# EAGLE schematic ds18b20-stm32f103 (EAGLE 7.2.0)
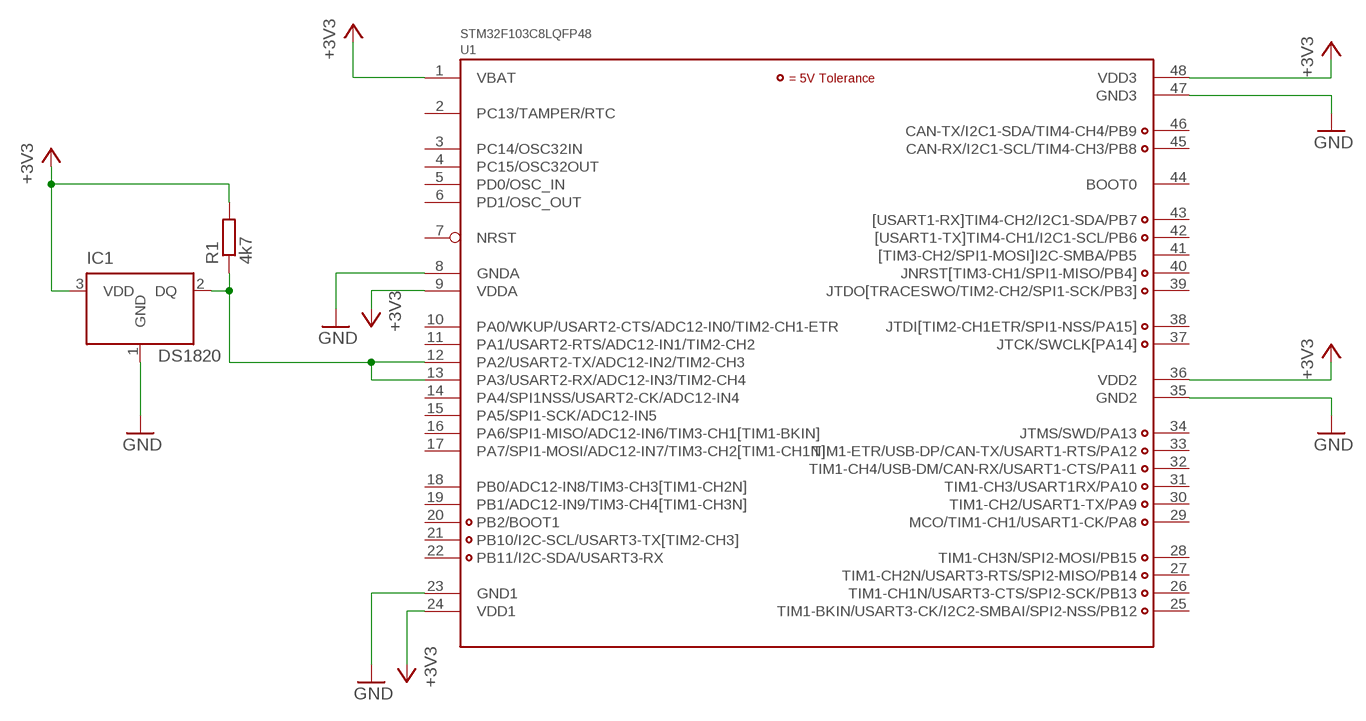
[diagram p0: schematic, sheet 1]

## Parts
IC1  DS1820  [TO-92]
R1  4k7  R-EU_R0805  [R0805]
U1  STM32F103C8LQFP48  [LQFP48]

## Nets
+3V3: IC1.3(VDD) R1.2 U1.1(VBAT) U1.9(VDDA) U1.24(VDD1) U1.36(VDD2) U1.48(VDD3)
GND: IC1.1(GND) U1.8(GNDA) U1.23(GND1) U1.35(GND2) U1.47(GND3)
N$2: IC1.2(DQ) R1.1 U1.12(PA2/USART2-TX/ADC12-IN2/TIM2-CH3) U1.13(PA3/USART2-RX/ADC12-IN3/TIM2-CH4)
Unconnected: U1.2(PC13/TAMPER/RTC) U1.3(PC14/OSC32IN) U1.4(PC15/OSC32OUT) U1.5(PD0/OSC_IN) U1.6(PD1/OSC_OUT) U1.7(NRST) U1.10(PA0/WKUP/USART2-CTS/ADC12-IN0/TIM2-CH1-ETR) U1.11(PA1/USART2-RTS/ADC12-IN1/TIM2-CH2) U1.14(PA4/SPI1NSS/USART2-CK/ADC12-IN4) U1.15(PA5/SPI1-SCK/ADC12-IN5) U1.16(PA6/SPI1-MISO/ADC12-IN6/TIM3-CH1[TIM1-BKIN]) U1.17(PA7/SPI1-MOSI/ADC12-IN7/TIM3-CH2[TIM1-CH1N]) U1.18(PB0/ADC12-IN8/TIM3-CH3[TIM1-CH2N]) U1.19(PB1/ADC12-IN9/TIM3-CH4[TIM1-CH3N]) U1.20(PB2/BOOT1) U1.21(PB10/I2C-SCL/USART3-TX[TIM2-CH3]) U1.22(PB11/I2C-SDA/USART3-RX) U1.25(TIM1-BKIN/USART3-CK/I2C2-SMBAI/SPI2-NSS/PB12) U1.26(TIM1-CH1N/USART3-CTS/SPI2-SCK/PB13) U1.27(TIM1-CH2N/USART3-RTS/SPI2-MISO/PB14) U1.28(TIM1-CH3N/SPI2-MOSI/PB15) U1.29(MCO/TIM1-CH1/USART1-CK/PA8) U1.30(TIM1-CH2/USART1-TX/PA9) U1.31(TIM1-CH3/USART1RX/PA10) U1.32(TIM1-CH4/USB-DM/CAN-RX/USART1-CTS/PA11) U1.33(TIM1-ETR/USB-DP/CAN-TX/USART1-RTS/PA12) U1.34(JTMS/SWD/PA13) U1.37(JTCK/SWCLK[PA14]) U1.38(JTDI[TIM2-CH1ETR/SPI1-NSS/PA15]) U1.39(JTDO[TRACESWO/TIM2-CH2/SPI1-SCK/PB3]) U1.40(JNRST[TIM3-CH1/SPI1-MISO/PB4]) U1.41([TIM3-CH2/SPI1-MOSI]I2C-SMBA/PB5) U1.42([USART1-TX]TIM4-CH1/I2C1-SCL/PB6) U1.43([USART1-RX]TIM4-CH2/I2C1-SDA/PB7) U1.44(BOOT0) U1.45(CAN-RX/I2C1-SCL/TIM4-CH3/PB8) U1.46(CAN-TX/I2C1-SDA/TIM4-CH4/PB9)

## Library data of the parts
IC1 = DS1820:DS1820: DS1820 - 1-Wire Digital Thermometer
R1 = rcl:R-EU_: RESISTOR, European symbol
U1 = STM32-easy-electronics:STM32F103C8